# Altium schematic sheet Connectors.SchDoc
size A4; SheetNumber: 6; SheetTotal: 6
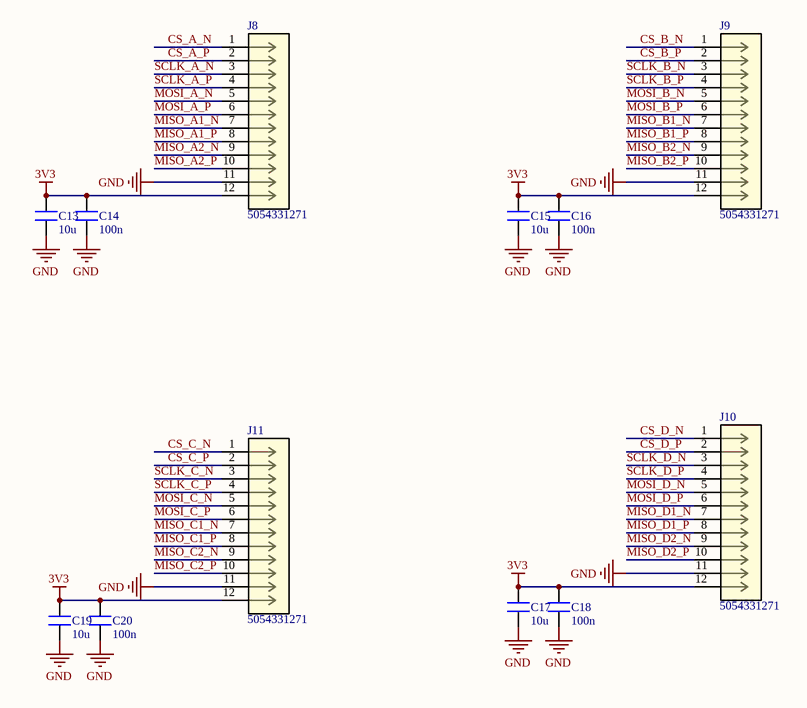
[diagram p0: Connectors.SchDoc]

## Parts
C13  10u  [C 0603_L]
C14  100n  [C 0402_L]
C15  10u  [C 0603_L]
C16  100n  [C 0402_L]
C17  10u  [C 0603_L]
C18  100n  [C 0402_L]
C19  10u  [C 0603_L]
C20  100n  [C 0402_L]
J8  5054331271  [CONN_505433_12_MOL]
J9  5054331271  [CONN_505433_12_MOL]
J10  5054331271  [CONN_505433_12_MOL]
J11  5054331271  [CONN_505433_12_MOL]

## Nets
3V3: C13.2 C14.2 C15.2 C16.2 C17.2 C18.2 C19.2 C20.2 J8.12 J9.12 J10.12 J11.12
GND: C13.1 C14.1 C15.1 C16.1 C17.1 C18.1 C19.1 C20.1 J8.11 J9.11 J10.11 J11.11
CS_A_N: J8.1
CS_A_P: J8.2
CS_B_N: J9.1
CS_B_P: J9.2
CS_C_N: J11.1
CS_C_P: J11.2
CS_D_N: J10.1
CS_D_P: J10.2
MISO_A1_N: J8.7
MISO_A1_P: J8.8
MISO_A2_N: J8.9
MISO_A2_P: J8.10
MISO_B1_N: J9.7
MISO_B1_P: J9.8
MISO_B2_N: J9.9
MISO_B2_P: J9.10
MISO_C1_N: J11.7
MISO_C1_P: J11.8
MISO_C2_N: J11.9
MISO_C2_P: J11.10
MISO_D1_N: J10.7
MISO_D1_P: J10.8
MISO_D2_N: J10.9
MISO_D2_P: J10.10
MOSI_A_N: J8.5
MOSI_A_P: J8.6
MOSI_B_N: J9.5
MOSI_B_P: J9.6
MOSI_C_N: J11.5
MOSI_C_P: J11.6
MOSI_D_N: J10.5
MOSI_D_P: J10.6
SCLK_A_N: J8.3
SCLK_A_P: J8.4
SCLK_B_N: J9.3
SCLK_B_P: J9.4
SCLK_C_N: J11.3
SCLK_C_P: J11.4
SCLK_D_N: J10.3
SCLK_D_P: J10.4

## Library data of the parts
C13 C15 C17 C19 = C_1_8
C14 C16 C18 C20 = C_1
J8-J11 = 5054331271: 1.25mm Pitch, Micro-Lock Plus PCB Header, Dual Row, Vertical, Surface Mount, Tin-Bismuth Plating, Positive Lock, 12 Circuits, Black; Manufacturer_Name: Molex Connector Corporation; Copyright: Copyright (C) 2025 Ultra Librarian. All rights reserved.; Manufacturer_Part_Number: 5054331271; RefDes: RefDes; Type: Type